# EasyEDA Pro project 控制板+驱动.eprj, board PCB_1
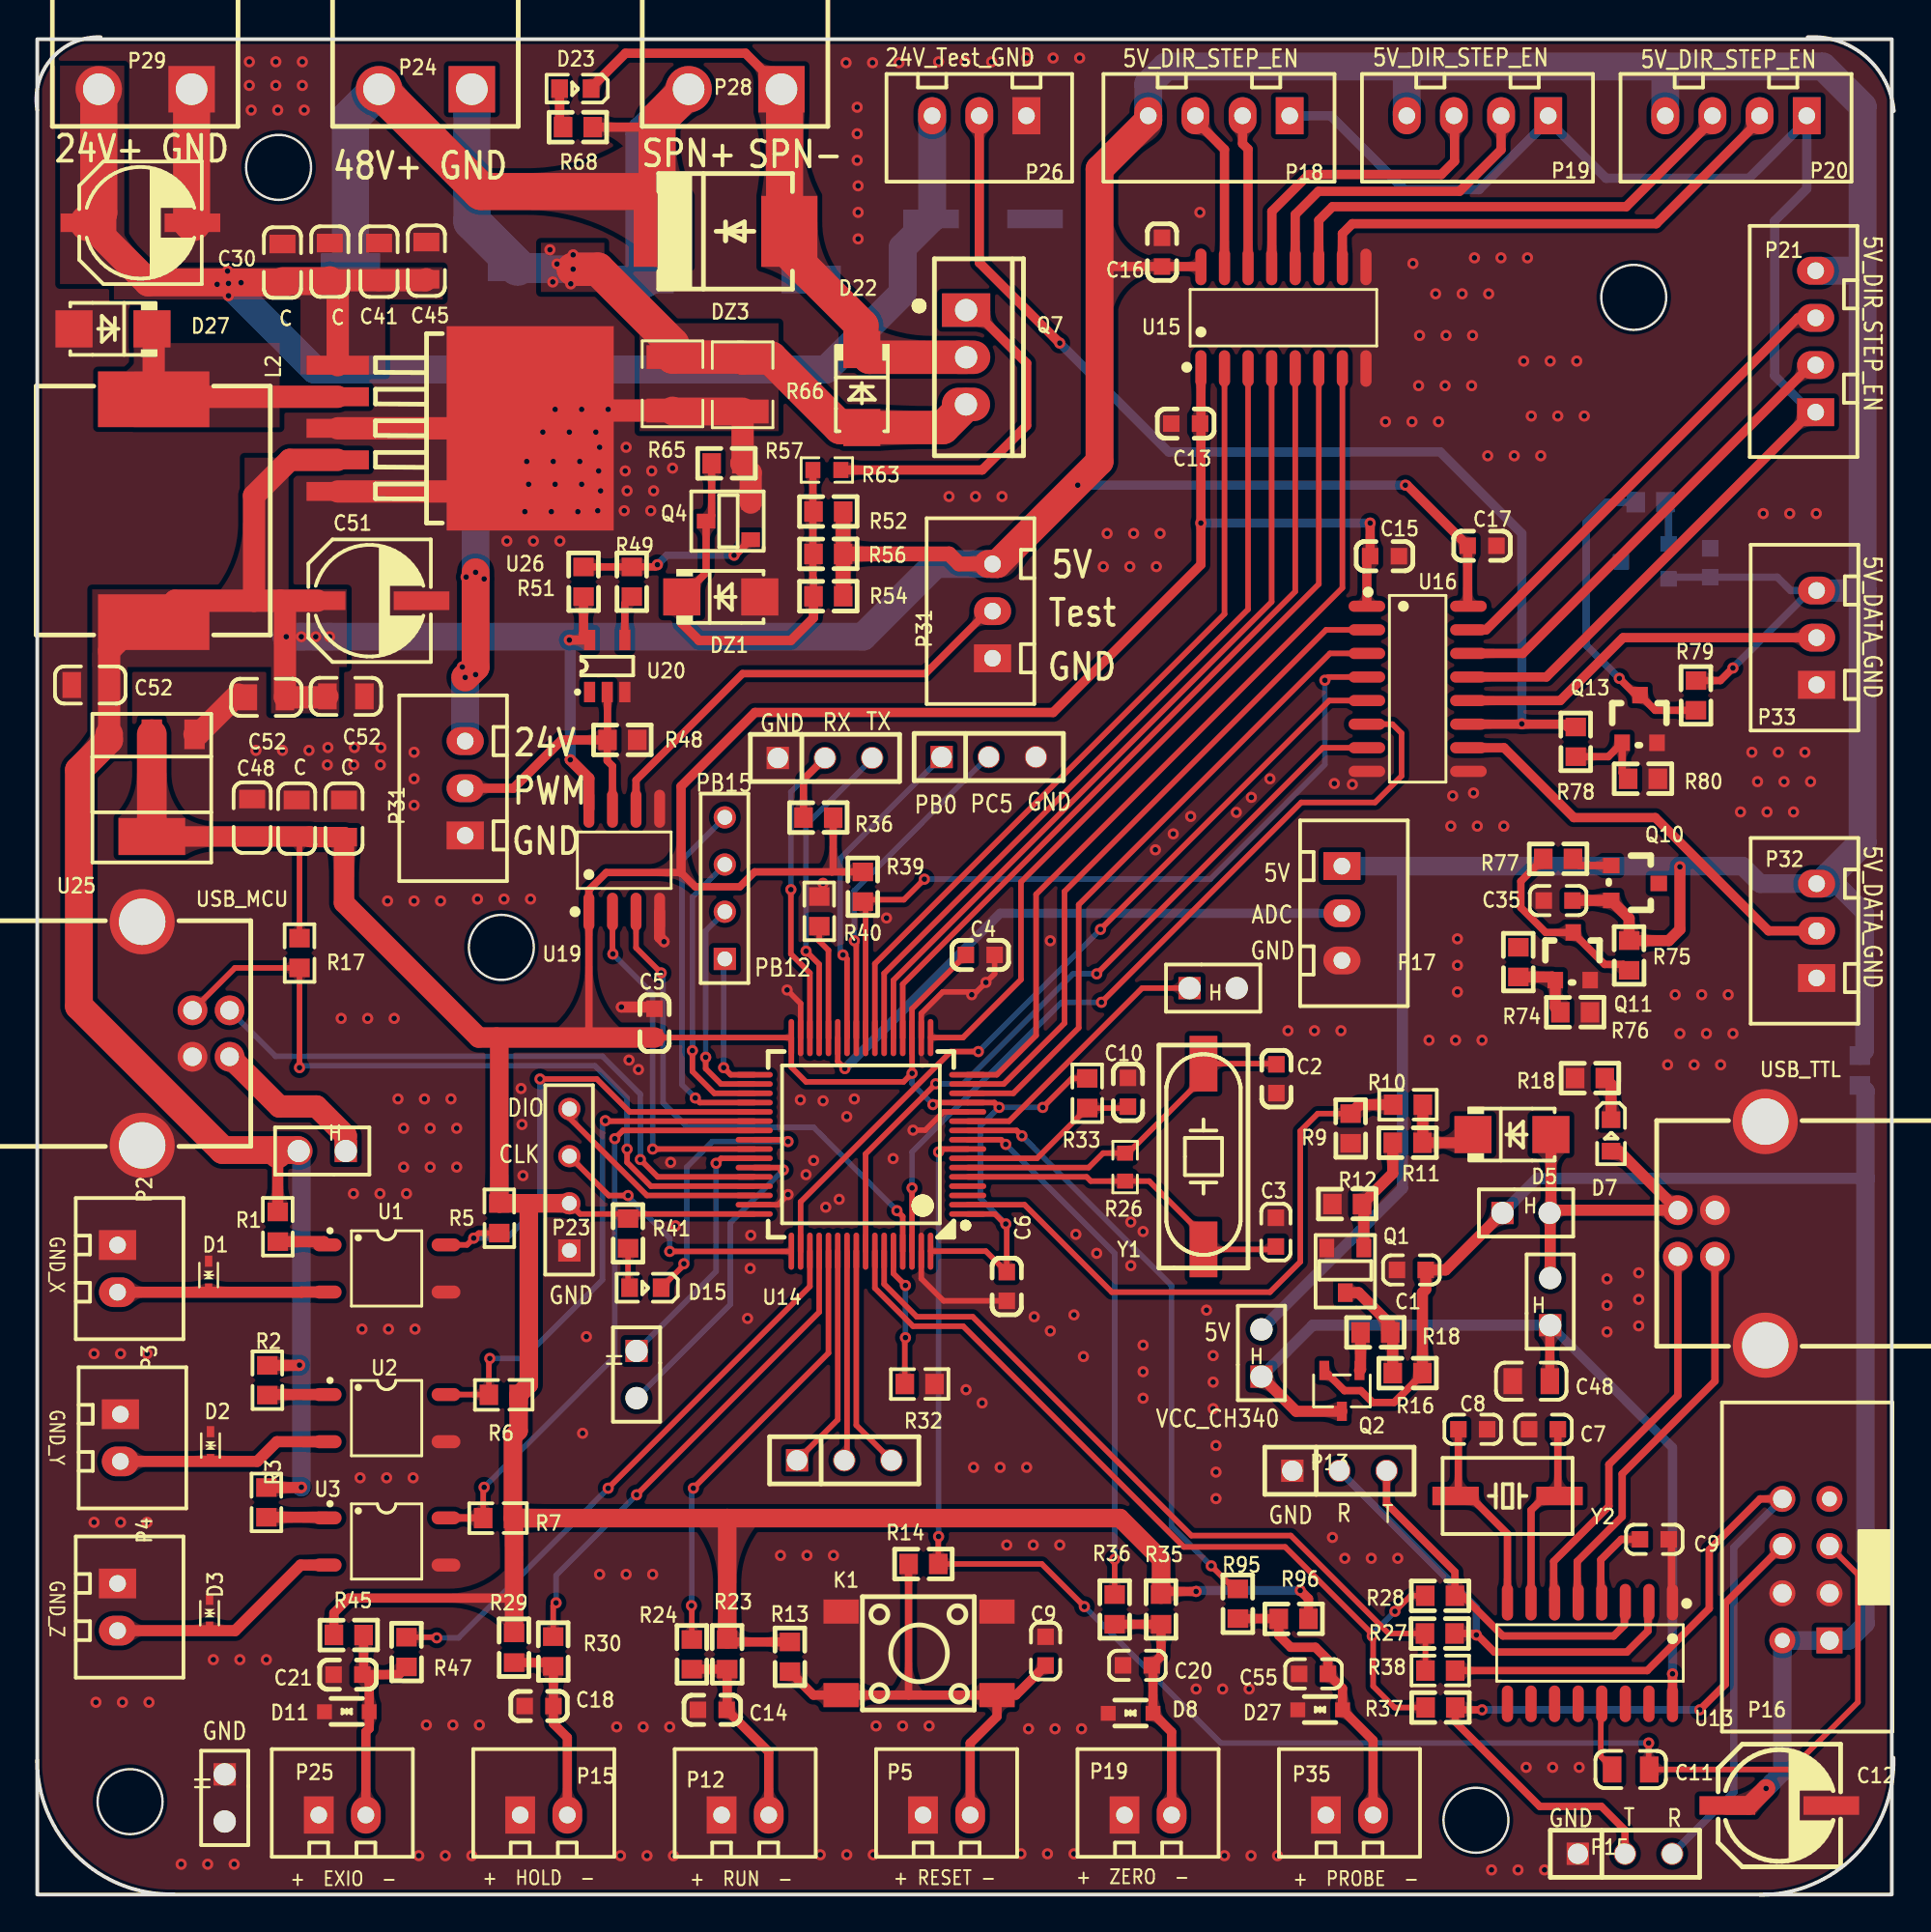
[diagram p4: board, top side]
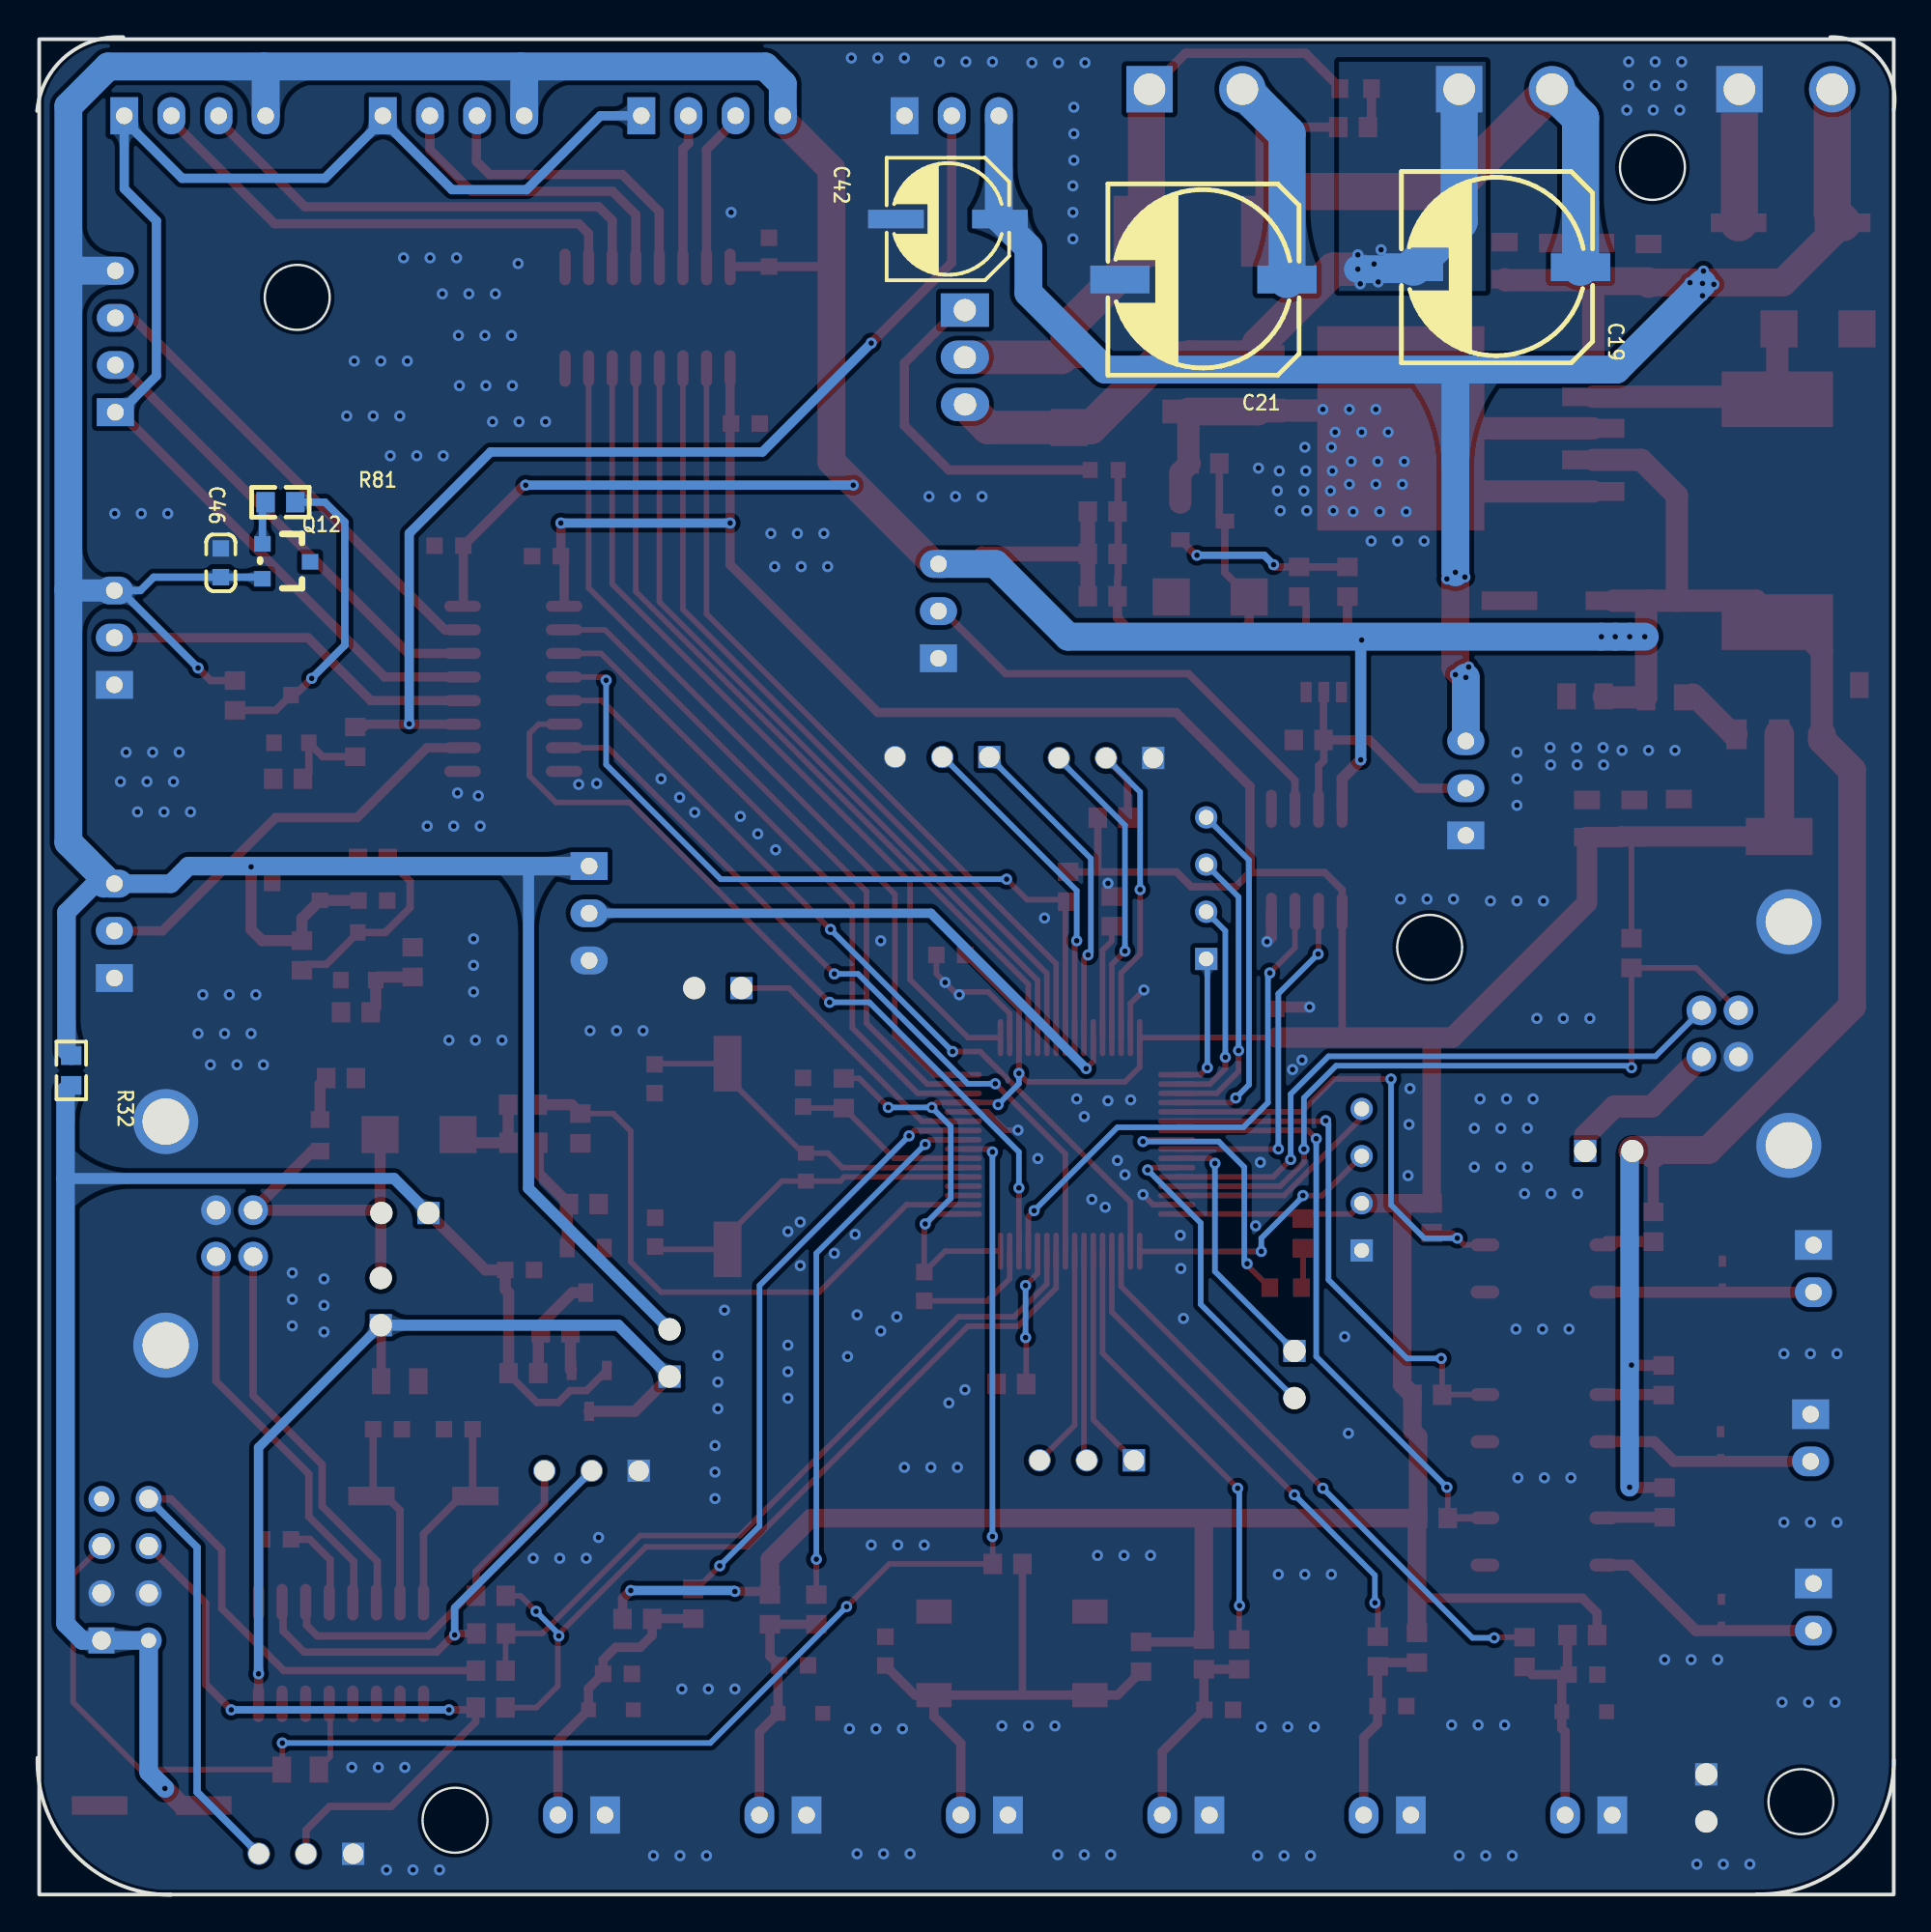
[diagram p5: board, bottom side, seen from below]

Outline 100.02 x 100.03 mm; copper layers: Top Layer, Bottom Layer. Coordinates in mm from the lower left corner of the outline.
Outline path: rectangle 0.01,99.92 99.91,0.02 ; circle c5.01,5.02 r1.75 ; circle c13.01,93.02 r1.75 ; circle c25.01,51.02 r1.75 ; circle c77.51,4.02 r1.75 ; circle c86.01,86.02 r1.75 ; 0.01,96.1 arc(0.78,98.88) 3.42,100.03 ; 7.37,0.03 arc(2.15,2.09) 0,7.27 ; 95.38,100.03 arc(98.5,98.98) 100.02,96.05 ; 100,7.38 arc(97.97,2.16) 92.81,0
Stack: Top Layer 0.035mm / Dielectric1 1.51mm FR4 er 4.5 / Bottom Layer 0.035mm

## Design rules (mm)
template: 用户自定义配置
spacing Default (default): track to track 0.152, other pairs 0 to 0.152
track width Default (default): min 0.254, default 0.254, max 25.4
differential pair differentialPair (default): width min 0.127, default 0.254, max 2.54; gap min 0.152, default 0.152
via Default (default): diameter min 0.25, default 0.61, max 100.025; hole min 0.2, default 0.305, max 59.995

## Placement (name value [footprint] x y rotation side)
C  -  [0805C]  16.53 57.95 270 top
C1  104  [0603C]  74.03 33.65 0 top
C2  -  [0603C]  66.76 43.95 270 top
C3  -  [0603C]  66.73 35.69 90 top
C4  104  [0603C]  50.8 50.61 180 top
C5  104  [0603C]  33.26 46.94 270 top
C6  104  [0603C]  52.23 32.76 90 top
C7  -  [0603C]  81.14 25.07 180 top
C8  -  [0603C]  77.33 25.07 0 top
C9  -  [0603C]  87.12 19.14 0 top
C9#2  -  [0603C]  54.32 13.12 270 top
C10  104  [0603C]  58.76 43.22 270 top
C11  104  [0805C]  85.84 6.75 0 top
C12  100uF/35V  [电解电容贴片6X6]  93.85 4.81 0 top
C13  104  [0603C]  61.87 79.22 180 top
C14  103  [0603C]  36.37 9.96 0 top
C15  104  [0603C]  72.58 72.08 0 top
C16  104  [0603C]  60.59 88.45 270 top
C17  104  [0603C]  77.83 72.64 180 top
C18  103  [0603C]  27.04 10.17 0 top
C19  100uF/63V  [电解电容贴片10x10]  21.12 87.74 0 bottom
C20  103  [0603C]  59.27 12.36 0 top
C21  -  [0603C]  16.74 11.86 0 top
C21#2  -  [电解电容贴片10x10]  36.93 87.08 0 bottom
C30  100uF/35V  [电解电容贴片6x6]  5.57 90.03 0 top
C35  104  [0603C]  81.93 53.54 0 top
C41  104  [0805C]  18.42 87.94 270 top
C42  100uF/35V  [电解电容贴片6x6]  50.96 90.24 0 bottom
C45  104  [0805C]  20.97 87.99 270 top
C46  104  [0603C]  90.12 71.72 270 bottom
C48  -  [0805C]  11.58 58.01 270 top
C48#2  -  [0805C]  80.49 27.66 0 top
C51  100uF/35V  [电解电容贴片6x6]  17.91 69.68 0 top
C52  -  [0805C]  12.35 64.48 0 top
C52#2  -  [0805C]  2.86 65.15 0 top
C52#3  -  [0805C]  16.63 64.53 180 top
C55  103  [0603C]  68.76 11.9 0 top
C#2  -  [0805C]  13.22 87.89 270 top
C#3  -  [0805C]  15.77 87.94 270 top
C#4  -  [0805C]  13.98 57.95 270 top
D1  ESD05V52D-C  [SOD-523_L1.2-W0.8-LS1.6-BI]  9.24 33.37 90 top
D2  ESD05V52D-C  [SOD-523_L1.2-W0.8-LS1.6-BI]  9.34 24.19 90 top
D3  ESD05V52D-C  [SOD-523_L1.2-W0.8-LS1.6-BI]  9.29 15.16 90 top
D5  SS56  [SMA]  79.44 40.94 0 top
D7  红光  [0603LED]  84.76 40.93 90 top
D8  PESD03V32D-LC  [SOD-323_L1.7-W1.3-LS2.5-BI]  58.9 9.77 0 top
D11  PESD03V32D-LC  [SOD-323_L1.7-W1.3-LS2.5-BI]  16.68 9.86 0 top
D15  绿光  [0603LED]  32.8 32.71 0 top
D22  SS56  [SMA]  44.43 81.11 270 top
D23  -̹-  [0603LED]  29.03 97.28 0 top
D27  -  [SOD-323_L1.7-W1.3-LS2.5-BI]  69.11 9.96 0 top
D27#2  -  [SMA]  4.09 84.32 180 top
DZ1  --ѹ------SMAZ10V  [SMA]  36.83 69.89 0 top
DZ3  RS5M  [SMC]  37.08 89.58 0 top
H  -  [HDR-TH_2P-P2.54-V-M]  80.21 36.72 0 top
H#2  -  [HDR-TH_2P-P2.54-V-M]  32.29 28.02 270 top
H#3  -  [HDR-TH_2P-P2.54-V-M]  65.95 29.18 90 top
H#4  -  [HDR-TH_2P-P2.54-V-M]  81.51 31.94 90 top
H#5  -  [HDR-TH_2P-P2.54-V-M]  63.35 48.83 0 top
H#6  -  [HDR-TH_2P-P2.54-V-M]  10.1 5.22 270 top
H#7  -  [HDR-TH_2P-P2.54-V-M]  15.36 40.05 180 top
K1  SW_6X6_H=12.0MM  [KEY-SMD_4P-L6.0-W6.0-P4.50-LS9.0]  47.51 13.01 0 top
L2  33uH  [IND-SMD_L13.45-W12.6]  6.28 74.53 270 top
P  PZ254V-11-03P  [HDR-TH_3P-P2.54-V-M]  51.26 61.27 0 top
P2  2P  [HDR1X2_CON]  4.33 33.72 270 top
P3  2P  [HDR1X2_CON]  4.48 24.61 270 top
P4  2P  [HDR1X2_CON]  4.33 15.5 270 top
P5  2P  [HDR1X2_CON]  48.99 4.3 0 top
P12  2P  [HDR1X2_CON]  38.14 4.3 0 top
P13  -  [HDR-TH_3P-P2.54-V-M]  70.15 22.84 0 top
P13#2  -  [HDR-TH_3P-P2.54-V-M]  43.48 23.4 0 top
P14  PZ254V-11-03P  [HDR-TH_3P-P2.54-V-M]  42.44 61.22 0 top
P15  -  [HDR-TH_3P-P2.54-V-M]  85.53 2.21 0 top
P15#2  -  [HDR1X2_CON]  27.29 4.3 0 top
P16  8P  [IDC8]  95.53 17.51 90 top
P17  3P  [HDR1X3_CON]  70.29 52.85 270 top
P18  4P  [HDR1X4_CON]  67.47 95.8 180 top
P19  -  [HDR1X4_CON]  81.4 95.8 180 top
P19#2  -  [HDR1X2_CON]  59.84 4.3 0 top
P20  4P  [HDR1X4_CON]  95.32 95.8 180 top
P21  4P  [HDR1X4_CON]  95.8 79.83 90 top
P23  -  [SIP4]  28.67 34.7 90 top
P23#2  -  [SIP4]  37.04 50.4 90 top
P24  DB2ER-5.0-2P-GN  [CONN-TH_2P-P5.00_DB2ER-5.0-2P-GN]  20.92 97.22 180 top
P25  2P  [HDR1X2_CON]  16.44 4.3 0 top
P26  3P  [HDR1X3_CON]  50.75 95.8 180 top
P28  DB2ER-5.0-2P-GN  [CONN-TH_2P-P5.00_DB2ER-5.0-2P-GN]  37.59 97.22 180 top
P29  DB2ER-5.0-2P-GN  [CONN-TH_2P-P5.00_DB2ER-5.0-2P-GN]  5.82 97.22 180 top
P31  -  [HDR1X3_CON]  23.06 59.59 90 top
P31#2  -  [HDR1X3_CON]  51.47 69.12 90 top
P32  3P  [HDR1X3_CON]  95.86 51.91 90 top
P33  3P  [HDR1X3_CON]  95.85 67.7 90 top
P35  2P  [HDR1X2_CON]  70.69 4.3 0 top
Q1  SS8050  [SOT-23]  70.47 33.63 180 top
Q2  AO3401  [SOT-23-3_L3.0-W1.7-P0.95-LS2.9-BR]  70.28 27.14 90 top
Q4  SS8050  [SOT-23]  37.24 73.97 90 top
Q7  IRFB4110PBF/不贴  [TO-220-3_L10.0-W4.5-P2.54-L]  50.04 82.79 270 top
Q10  AO3401  [SOT-23#2]  84.79 55.43 270 top
Q11  SS8050  [SOT-23#2]  81.78 49.26 0 top
Q12  AO3401  [SOT-23#2]  87.88 72.74 270 bottom
Q13  SS8050  [SOT-23#2]  85.38 62.03 0 top
R1  1K  [0603R]  12.96 35.97 270 top
R2  1K  [0603R]  12.4 27.71 270 top
R3  1K  [0603R]  12.35 21.13 270 top
R5  10K  [0603R]  24.89 36.43 270 top
R6  10K  [0603R]  25.13 26.92 180 top
R7  10K  [0603R]  24.83 20.29 180 top
R9  10K  [0603R]  70.75 41.27 270 top
R10  5.1K  [0603R]  73.84 42.55 180 top
R11  2K  [0603R]  73.82 40.5 0 top
R12  10K  [0603R]  70.57 37.2 0 top
R13  10K  [0603R]  40.55 12.82 90 top
R14  100  [0603R]  47.74 17.82 180 top
R16  10K  [0603R]  73.82 28.09 0 top
R17  -  [0603R]  14.13 50.71 270 top
R18  -  [0603R]  83.65 43.98 180 top
R18#2  -  [0603R]  72.09 30.28 0 top
R23  10K  [0603R]  37.17 12.95 90 top
R24  100  [0603R]  35.27 12.95 270 top
R26  1M  [R0603]  58.61 39.19 90 top
R27  510Ω  [0603R]  75.56 14.07 180 top
R28  510Ω  [0603R]  75.58 16.1 180 top
R29  10K  [0603R]  25.69 13.31 90 top
R30  100  [0603R]  27.8 13.1 270 top
R32  -  [0603R]  47.54 27.51 180 top
R32#2  -  [0603R]  98.18 44.39 270 bottom
R33  -  [0603R]  56.57 43.16 270 top
R35  10K  [0603R]  60.54 15.37 90 top
R36  -  [0603R]  42.08 58.01 0 top
R36#2  -  [0603R]  58.04 15.37 270 top
R37  510Ω  [0603R]  75.59 10.09 0 top
R38  510Ω  [0603R]  75.58 12.08 0 top
R39  -  [0603R]  44.48 54.28 90 top
R40  10K  [0603R]  42.13 52.96 90 top
R41  50K  [0603R]  31.83 35.62 90 top
R45  10K  [0603R]  16.79 13.99 180 top
R47  100  [0603R]  19.9 13.07 270 top
R48  10K  [0603R]  31.53 62.19 0 top
R49  100  [0603R]  32.03 70.7 90 top
R51  10K  [0603R]  29.43 70.7 270 top
R52  20K  [0603R]  42.62 74.48 0 top
R54  20K  [0603R]  42.62 69.92 0 top
R56  20K  [0603R]  42.62 72.2 0 top
R57  10K  [0603R]  37.13 77.08 0 top
R63  100Ω  [R0603]  42.54 76.72 0 top
R65  0Ω  [R1210]  34.23 81.36 90 top
R66  0Ω  [R1210]  38 81.31 90 top
R68  200K  [0603R]  29.13 95.19 180 top
R74  3K  [0603R]  79.79 50.22 90 top
R75  10K  [0603R]  85.76 50.58 90 top
R76  10K  [0603R]  82.85 47.52 0 top
R77  1K  [0603R]  81.93 55.78 0 top
R78  3K  [0603R]  82.88 62.09 90 top
R79  10K  [0603R]  89.36 64.58 90 top
R80  10K  [0603R]  86.5 60.1 0 top
R81  1K  [0603R]  86.91 74.99 0 bottom
R95  100  [0603R]  64.68 15.68 270 top
R96  10K  [0603R]  67.68 14.86 0 top
U1  LTV-357T-C  [SOP-4_L4.4-W3.9-P2.54-LS7.0-TL]  18.82 33.73 0 top
U2  LTV-357T-C  [SOP-4_L4.4-W3.9-P2.54-LS7.0-TL]  18.82 25.67 0 top
U3  LTV-357T-C  [SOP-4_L4.4-W3.9-P2.54-LS7.0-TL]  18.82 19.03 0 top
U13  CH340G  [SOIC-16_L9.9-W3.9-P1.27-LS6.0-BL]  83.65 13.02 180 top
U14  STM32F103RBT6/RCT6  [LQFP-64_L10.0-W10.0-P0.50-LS12.0-BL]  44.38 40.41 90 top
U15  CA-IS3760  [SOIC-16_L9.9-W3.9-P1.27-LS6.0-BL]  67.14 84.92 0 top
U16  CA-IS3760  [SOIC-16_L9.9-W3.9-P1.27-LS6.0-BL]  74.37 64.94 270 top
U19  CA-IS3720LS  [SOIC-8_L4.9-W3.9-P1.27-LS6.0-BL]  31.63 55.71 0 top
U20  74LVC1G04  [SOT-23-5]  30.71 66.17 90 top
U25  1117-3.3  [SOT-223]  6.18 59.79 180 top
U26  LM2596S-5.0RG  [TO-263-5_L10.1-W8.7-P1.70-LS15.2-BR]  21.38 78.97 180 top
USB_MCU  USB-B10-BRW  [USB-B-TH_USB-B10-BRW]  8.01 46.38 270 top
USB_TTL  USB-B10-BRW  [USB-B-TH_USB-B10-BRW]  90.74 35.62 90 top
Y1  8M  [晶振贴片]  62.83 39.76 90 top
Y2  12M  [晶振贴片49SSMD]  79.21 21.48 0 top

## Footprints (pads in the part's own frame, mm; a bottom-side part is the same pattern mirrored in y, then rotated)
0603C
  rect 0.889x0.889 smd: 1(-0.774,0) 2(0.774,0)
0603LED
  rect 0.9x1 smd: 1(-0.884,-0.017) 2(0.816,-0.017)
0603R
  rect 1x1.1 smd: 1(-0.8,0) 2(0.8,0)
0805C
  rect 1x1.4 smd: 1(-1,0) 2(1,0)
CONN-TH_2P-P5.00_DB2ER-5.0-2P-GN
  rect 2.5x2.5 hole 1.7: 1(-2.5,0)
  round 2.5 hole 1.7: 2(2.5,0)
HDR1X2_CON
  rect 1.6x2 hole 0.9: 1(-1.27,0)
  oval 1.6x2 hole 0.9: 2(1.27,0)
HDR1X3_CON
  rect 1.5x2 hole 0.9: 1(-2.54,0)
  oval 1.5x2 hole 0.9: 2(0,0) 3(2.54,0)
HDR1X4_CON
  rect 1.5x2 hole 0.9: 1(0,0)
  oval 1.5x2 hole 0.9: 2(2.54,0) 3(5.08,0) 4(7.62,0)
HDR-TH_2P-P2.54-V-M
  rect 1.2x1.2 hole 1.2x0.8: 1(-1.27,0)
  round 1.2 hole 1.2x0.8: 2(1.27,0)
HDR-TH_3P-P2.54-V-M
  rect 1.2x1.2 hole 1.1x0.8: 1(-2.54,0)
  round 1.2 hole 1.1x0.8: 2(0,0) 3(2.54,0)
IDC8
  rect 1.4x1.4 hole 1: 1(-3.812,-1.019)
  round 1.4 hole 0.8: 2(-3.812,1.521) 7(3.808,-1.019)
  round 1.4 hole 1: 3(-1.272,-1.019) 4(-1.272,1.521) 5(1.268,-1.019) 6(1.268,1.521) 8(3.808,1.521)
IND-SMD_L13.45-W12.6
  rect 3x6 smd: 1(-6,0) 2(6,0)
KEY-SMD_4P-L6.0-W6.0-P4.50-LS9.0
  rect 1.9x1.3 smd: 1(-4.2,2.25) 2(4.2,2.25) 3(-4.2,-2.25) 4(4.2,-2.25)
LQFP-64_L10.0-W10.0-P0.50-LS12.0-BL
  oval 0.3x2 smd: 1(-3.75,-5.75) 2(-3.25,-5.75) 3(-2.75,-5.75) 4(-2.25,-5.75) 5(-1.75,-5.75) 6(-1.25,-5.75) 7(-0.75,-5.75) 8(-0.25,-5.75) 9(0.25,-5.75) 10(0.75,-5.75) 11(1.25,-5.75) 12(1.75,-5.75) 13(2.25,-5.75) 14(2.75,-5.75) 15(3.25,-5.75) 16(3.75,-5.75) 33(3.75,5.75) 34(3.25,5.75) 35(2.75,5.75) 36(2.25,5.75) 37(1.75,5.75) 38(1.25,5.75) 39(0.75,5.75) 40(0.25,5.75) 41(-0.25,5.75) 42(-0.75,5.75) 43(-1.25,5.75) 44(-1.75,5.75) 45(-2.25,5.75) 46(-2.75,5.75) 47(-3.25,5.75) 48(-3.75,5.75)
  oval 2x0.3 smd: 17(5.75,-3.75) 18(5.75,-3.25) 19(5.75,-2.75) 20(5.75,-2.25) 21(5.75,-1.75) 22(5.75,-1.25) 23(5.75,-0.75) 24(5.75,-0.25) 25(5.75,0.25) 26(5.75,0.75) 27(5.75,1.25) 28(5.75,1.75) 29(5.75,2.25) 30(5.75,2.75) 31(5.75,3.25) 32(5.75,3.75) 49(-5.75,3.75) 50(-5.75,3.25) 51(-5.75,2.75) 52(-5.75,2.25) 53(-5.75,1.75) 54(-5.75,1.25) 55(-5.75,0.75) 56(-5.75,0.25) 57(-5.75,-0.25) 58(-5.75,-0.75) 59(-5.75,-1.25) 60(-5.75,-1.75) 61(-5.75,-2.25) 62(-5.75,-2.75) 63(-5.75,-3.25) 64(-5.75,-3.75)
R0603
  rect 0.806x0.864 smd: 1(-0.753,0) 2(0.753,0)
R1210
  rect 1.282x2.808 smd: 1(-1.441,0) 2(1.441,0)
SIP4
  rect 1.2x1.2 hole 0.8: 1(0,0)
  round 1.2 hole 0.8: 2(2.54,0) 3(5.08,0) 4(7.62,0)
SMA
  rect 2x2 smd: 1(2.1,0) 2(-2.1,0)
SMC
  rect 3.03x3.82 smd: 1(3.435,0) 2(-3.435,0)
SOD-323_L1.7-W1.3-LS2.5-BI
  rect 0.8x0.8 smd: 1(-1.205,0) 2(1.205,0)
SOD-523_L1.2-W0.8-LS1.6-BI
  rect 0.6x0.4 smd: 1(-0.75,0) 2(0.75,0)
SOIC-8_L4.9-W3.9-P1.27-LS6.0-BL
  oval 0.588x2.045 smd: 1(-1.905,-2.772) 2(-0.635,-2.772) 3(0.635,-2.772) 4(1.905,-2.772) 5(1.905,2.772) 6(0.635,2.772) 7(-0.635,2.772) 8(-1.905,2.772)
SOIC-16_L9.9-W3.9-P1.27-LS6.0-BL
  oval 0.602x1.971 smd: 1(-4.445,-2.736) 2(-3.175,-2.736) 3(-1.905,-2.736) 4(-0.635,-2.736) 5(0.635,-2.736) 6(1.905,-2.736) 7(3.175,-2.736) 8(4.445,-2.736) 9(4.445,2.736) 10(3.175,2.736) 11(1.905,2.736) 12(0.635,2.736) 13(-0.635,2.736) 14(-1.905,2.736) 15(-3.175,2.736) 16(-4.445,2.736)
SOP-4_L4.4-W3.9-P2.54-LS7.0-TL
  oval 1.55x0.7 smd: 1(-3.2,1.27) 2(-3.2,-1.27) 3(3.2,-1.27) 4(3.2,1.27)
SOT-23
  rect 0.8x1 smd: 1(-1,-1.2) 2(0,1.2) 3(1,-1.2)
SOT-23#2
  rect 0.838x0.889 smd: 1(0,0) 2(1.879,0) 3(0.965,2.566)
SOT-23-3_L3.0-W1.7-P0.95-LS2.9-BR
  rect 1.038x0.532 smd: 1(1.101,-0.95) 2(1.101,0.95) 3(-1.101,0)
SOT-23-5
  rect 1.1x0.6 smd: 1(-1.4,0.95) 2(-1.4,0) 3(-1.4,-0.95) 4(1.4,-0.95) 5(1.4,0.95)
SOT-223
  rect 1.1x1.6 smd: 1(-2.3,-2.7) 2(0,-2.7) 3(2.3,-2.7)
  rect 3.6x2 smd: 4(0,2.8)
TO-220-3_L10.0-W4.5-P2.54-L
  rect 1.8x2.6 hole 1.2: 1(-2.54,0.005)
  oval 1.8x2.6 hole 1.2: 2(0,0.005) 3(2.54,-0.005)
TO-263-5_L10.1-W8.7-P1.70-LS15.2-BR
  rect 3.358x1.02 smd: 1(5.183,-3.4) 2(5.183,-1.7) 3(5.183,0) 4(5.183,1.7) 5(5.183,3.4)
  rect 9x11 smd: 6(-5.184,0)
USB-B-TH_USB-B10-BRW
  round 1.6 hole 1: 1(1.25,2.355) 2(-1.25,2.355) 3(-1.25,0.355) 4(1.25,0.355)
  round 3.5 hole 2.5: 5(-6.02,-2.355) 6(6.02,-2.355)
晶振贴片
  rect 3x1.5 smd: 1(-5,0) 2(5,0)
晶振贴片49SSMD
  rect 2.5x1 smd: 1(-2.8,0) 2(2.8,0)
电解电容贴片6x6
  rect 3x1 smd: 1(-2.8,0) 2(2.8,0)
电解电容贴片6X6
  rect 3x1 smd: 1(-2.8,0) 2(2.8,0)
电解电容贴片10x10
  rect 3.2x1.5 smd: 1(-4.242,0.097) 2(4.758,0.097)

## Nets
3V3: C.2 C4.2 C5.2 C6.2 C13.1 C15.1 C48.2 C#4.2 P23.2 R5.1 R6.1 R7.1 R13.2 R17.1 R23.2 R29.2 R33.1 R35.2 R36.2 R39.2 R41.2 R45.2 R96.2 U14.1 U14.13 U14.19 U14.32 U14.48 U14.64 U15.1 U16.1 U19.1 U25.2 U25.4
5V_DIS: C1.2 C12.1 H.1 P16.1 P16.2 Q2.2 R16.2 R32#2.2
5V_VCC: C16.2 C17.2 C35.2 C46.2 C51.1 C52.2 C52#2.2 C52#3.2 H#3.2 H#7.2 L2.2 P17.1 P18.4 P19.4 P20.4 P21.4 P31#2.3 P32.3 P33.3 Q10.2 Q12.2 R1.1 R2.1 R3.1 R32#2.1 R51.2 R52.2 R54.2 R56.2 R75.2 R79.2 U15.16 U16.16 U19.8 U20.5 U25.3 U26.4
5V_VCC2: H#7.1 USB_MCU.1
24V: C30.1 C41.2 C42.1 C45.2 C#2.2 C#3.2 P26.3 P29.2 P31.3 U26.1
48V_SPN-: C19.2 D22.1 P24.1 Q7.3 R65.2 R66.2
SGND: C.1 C1.1 C2.2 C3.2 C4.1 C5.1 C6.1 C7.2 C8.2 C9.2 C9#2.1 C10.1 C12.2 C13.2 C14.1 C15.2 C16.1 C17.1 C18.1 C20.1 C21.1 C21#2.2 C30.2 C35.1 C41.1 C42.2 C45.1 C46.1 C48.1 C48#2.1 C51.2 C52.1 C52#2.1 C52#3.1 C55.1 C#2.1 C#3.1 C#4.1 D1.2 D2.2 D3.2 D8.1 D11.1 D27.1 D27#2.1 DZ1.1 H#5.2 H#6.1 H#6.2 K1.1 K1.2 P.3 P2.1 P3.1 P4.1 P5.1 P12.1 P13.1 P14.1 P15.1 P15#2.1 P16.3 P16.4 P17.3 P19#2.1 P23.1 P25.1 P26.1 P29.1 P31.1 P31#2.1 P32.1 P33.1 P35.1 Q1.3 Q4.3 Q11.2 Q13.2 R9.2 R12.1 R18.2 R32.1 R40.2 R48.2 R57.2 R65.1 R66.1 R76.2 R80.2 U1.3 U2.3 U3.3 U13.1 U14.12 U14.18 U14.31 U14.47 U14.63 U15.8 U15.9 U16.8 U16.9 U19.4 U19.5 U20.3 U25.1 U26.3 U26.5 U26.6 USB_MCU.4 USB_MCU.5 USB_MCU.6 USB_TTL.4 USB_TTL.5 USB_TTL.6
ADC: P17.2 U14.27
BEEP: H#5.1 U14.11
BOOT0: R32.2 U14.60
BOOT1: R40.1 U14.28
D+: R17.2 U14.45 USB_MCU.3
D-: U14.44 USB_MCU.2
EXIO: R47.1 U14.51
HOLD: R30.1 U14.52
LASER_CTRL: P.1 U14.26
LED_SYS: D15.2 U14.40
M_EN_OUT: P18.1 P19.1 P20.1 P21.1 U16.13
MA_DIR: U14.15 U16.2
MA_DIR_OUT: P21.3 U16.15
MA_ST_OUT: P21.2 U16.14
MA_STEP: U14.14 U16.3
MOTOR_EN: R39.1 U14.24 U16.4
MX_DIR: U14.23 U15.2
MX_DIR_OUT: P18.3 U15.15
MX_ST_OUT: P18.2 U15.14
MX_STEP: U14.22 U15.3
MY_DIR: U14.21 U15.4
MY_DIR_OUT: P19.3 U15.13
MY_ST_OUT: P19.2 U15.12
MY_STEP: U14.20 U15.5
MZ_DIR: U14.17 U15.6
MZ_DIR_OUT: P20.3 U15.11
MZ_ST_OUT: P20.2 U15.10
MZ_STEP: U14.16 U15.7
NRST: C10.2 R33.2 U14.7
PA9: H#2.1 U14.42
PA10: H#2.2 U14.43
PB3: P13#2.2 U14.55
PB4: P13#2.3 U14.56
PD2: P13#2.1 U14.54
PROBE: R95.1 U14.10
PUMP_CTRL: P.2 U14.25
PWM_COOL: U14.61 U19.3
PWM_OUT: P31#2.2 U19.6
RGB_DATA1: U14.57 U16.7
RGB_DATA2: U14.50 U16.5
RGB_OUT1: P32.2 U16.10
RGB_OUT2: P33.2 U16.12
RGB_P1: P23#2.3 U14.35
RGB_P2: P23#2.4 U14.36
RGB_PO1: R74.2
RGB_PO2: P26.2 R78.2 U16.11
RST: C11.2 P16.5 R14.1 U14.8
RUN: R24.1 U14.53
RXD: R27.2 R38.1 U14.59
RXD3: P14.2 R36.1 U14.30
SPINDLE_EN0: P23#2.1 U14.33
SPINDLE_EN1: P23#2.2 U14.34
SPINDLE_OUT: P31.2 R48.1 U19.7 U20.2
SPINDLE_PWM: U14.41 U19.2
SPN+: C19.1 C21#2.1 DZ3.2 P24.2 P28.2 R68.1
SPN_PWM: DZ1.2 Q4.2 R52.1 R54.1 R56.1 R57.1 R63.1
SPN_PWM_OUT: Q7.1 R63.2
SWCLK: P23.3 U14.49
SWDIO: P23.4 U14.46
TIM4_CH4: U14.62 U16.6
TXD: R28.2 R37.1 U14.58
TXD3: P14.3 U14.29
USB_CHK: R9.1 R10.2 U14.2
USB_DM: U13.6 USB_TTL.2
USB_DP: U13.5 USB_TTL.3
VCH340: C48#2.2 H#3.1 H#4.1 Q2.3 U13.16
VUSB: D5.1 D7.1 H.2 H#4.2 USB_TTL.1
X_LIMT: R5.2 U1.4 U14.37
X_LO: D1.1 P2.2 U1.2
XTAL1: C3.1 R26.1 U14.5 Y1.1
XTAL2: C2.1 R26.2 U14.6 Y1.2
Y_LIMT: R6.2 U2.4 U14.38
Y_LO: D2.1 P3.2 U2.2
Z_LIMT: R7.2 U3.4 U14.39
Z_LO: D3.1 P4.2 U3.2
ZERO: R36#2.1 U14.9
$1N23: C14.2 P12.2 R23.1 R24.2
$1N24: C18.2 P15#2.2 R29.1 R30.2
$1N115: C21.2 D11.2 P25.2 R45.1 R47.2
$1N25015: C9.1 U13.4
$1N25025: C11.1 U13.13
$1N25043: C7.1 U13.7 Y2.2
$1N25047: C8.1 U13.8 Y2.1
$1N25180: D15.1 R41.1
$1N25225: U14.3
$1N25227: U14.4
$1N25288: P15.2 P16.6 R37.2
$1N25293: P15.3 P16.8 R38.2
$1N25300: R1.2 U1.1
$1N25317: Q2.1 R18#2.1
$1N25319: Q1.2 R16.1 R18#2.2
$1N25330: P13.2 R27.1 U13.2
$1N25334: P13.3 R28.1 U13.3
$1N25342: D7.2 R18.1
$1N25345: Q1.1 R11.1 R12.2
$1N25456: R2.2 U2.1
$1N25466: R3.2 U3.1
$1N25569: D5.2 R10.1 R11.2
$1N28653: C9#2.2 K1.3 K1.4 P5.2 R13.1 R14.2
$1N38223: C20.2 D8.2 P19#2.2 R35.1 R36#2.2
$1N68371: C55.2 D27.2 P35.2 R95.2 R96.1
$6N26743: D22.2 D23.2 DZ3.1 P28.1 Q7.2
$6N26746: D23.1 R68.2
$6N26802: Q4.1 R49.2 R51.1
$6N26803: R49.1 U20.4
$6N26814: Q13.1 R78.1 R80.1
$6N26816: Q12.1 R81.2
$6N26817: Q13.3 R79.1 R81.1
$6N26821: Q12.3
$6N26825: Q11.1 R74.1 R76.1
$6N26827: Q10.1 R77.2
$6N26828: Q11.3 R75.1 R77.1
$6N26832: Q10.3
$6N26878: D27#2.2 L2.1 U26.2

Pads without a net: P16 7; U13 9 10 11 12 14 15; U20 1

## Via types
v1: diameter 0.6, hole 0.3, Top Layer to Bottom Layer, 398 vias

## Routing (per net, layer and track width the routed paths; a pad name or vN(x,y) marks a point on that pad's centre or on a via; arc(x,y) is an arc through that point)
3V3: length 299.3
  Top Layer w0.3: C#4.2 14.13,56.8 R17.1 ; v1(51.82,42.4) 51.56,42.66 U14.13 48.36,42.66 v1(48.25,42.55) ; U14.64 51.11,34.66 C6.2 52.23,36.02 51.59,36.66 U14.1 ; U14.48 29.25,36.66 P23.2 ; v1(54.17,42.4) 55.73,43.96 R33.1 ; C5.2 34,46.16 34.01,46.16 U14.32 40.63,44.57 41.42,43.78 46.67,43.78 v1(47.13,44.24) 47.13,46.16 U14.19 47.13,47.71 C4.2
  Top Layer w0.4: 42.82,55.08 42.88,55.14 R36.2 ; 42.82,55.08 38.65,55.08 37.85,54.28 35.45,54.28 34.69,55.05 30.66,55.05 29.72,54.11 U19.1 29.72,46.61 29.48,46.38 ; 42.82,55.08 R39.2
  Top Layer w0.5: v1(62.43,16.34) 60.71,16.34 R35.2 ; 25.69,16.15 25.52,15.98 16.79,15.98 15.99,15.18 R45.2 ; U16.1 71.63,71.91 71.81,72.08 v1(71.81,73.87) ; U15.1 62.69,71.63 54.73,63.67 38.66,63.67 34.69,59.69 34.69,55.05 ; v1(68.04,16.39) 68.48,15.95 R96.2 ; R23.2 37.3,13.62 R13.2
  Top Layer w1: 24.75,46.16 24.89,46.02 R5.1 24.9,37.24 26.49,37.24 ; R7.1 25.69,20.23 R29.2 ; R7.1 37.17,20.29 ; R7.1 25.63,24.67 25.93,24.98 R6.1 26.49,27.48 26.49,37.24 ; P23.2 26.49,37.24 ; R23.2 37.17,20.29 ; 37.17,20.29 58.33,20.29 60.54,18.07 R35.2
  Top Layer w1.1: U25.4 14.69,56.99 14.73,56.95 C.2 16.53,53.42 23.78,46.16 C5.2
  Top Layer w1.6: U25.2 U25.4
  Bottom Layer w0.3: v1(47.13,44.24) 47.13,43.67 v1(48.25,42.55) ; v1(52.18,36.13) 50.8,37.5 50.8,41.38 v1(51.82,42.4) v1(54.17,42.4)
  Bottom Layer w0.5: v1(68.04,16.39) 62.48,16.39 v1(62.43,16.34) ; v1(71.81,73.87) v1(62.69,73.87)
5V_DIS: length 82.8
  Top Layer w0.4: Q2.2 70.42,27.15 71.31,27.15 71.94,26.51 73.1,26.51 74.62,28.04
  Top Layer w0.6: H.1 75.87,33.65 C1.2 74.8,32.61 74.62,32.43 R16.2
  Top Layer w1: C12.1 92.22,4.81 v1(93.13,5.73)
  Bottom Layer w0.6: 98.49,38.57 80.79,38.57 H.1
  Bottom Layer w1: R32#2.2 98.49,43.28 98.49,14.61 97.58,13.7 P16.1 P16.2 94.01,6.61 v1(93.13,5.73)
5V_VCC: length 401.5
  Top Layer w0.4: v1(91.35,66.06) 90.67,65.38 R79.2
  Top Layer w0.5: 57.64,87.84 57.8,87.68 C16.2 62.67,87.68 U15.16 ; U16.16 77.06,69.43 77.06,72.34 ; R51.2 29.43,67.89 U20.5 v1(28.67,67.57) ; v1(73.7,75.91) 73.79,75.91 C17.2
  Top Layer w0.6: v1(28.72,61.12) 29.72,60.11 U19.8 ; v1(88.49,55.35) 88.49,51.98 87.89,51.38 R75.2 85.76,52.58 84.79,53.55 82.71,53.55 C35.2 ; v1(14.13,28.53) 14.12,28.51 R2.1 ; v1(14.24,21.95) 14.22,21.93 R3.1 ; 12.96,39.87 R1.1
  Top Layer w0.8: R56.2 R54.2 ; R56.2 R52.2 ; R56.2 49.13,72.2 49.67,71.66 P31#2.3
  Top Layer w1.2: 11.69,69.68 11.69,75.35 13.61,77.27 U26.4 ; 11.69,69.68 7.43,69.68 L2.2 5.43,68.53 3.88,66.98 U25.3 ; 11.69,69.68 13.11,69.68 ; 13.11,69.68 13.35,69.45 C52.2 15.58,64.48 C52#3.2 ; 13.11,69.68 C51.1
  Top Layer w1.5: 12.73,40.1 10,40.1 2.25,47.86 2.25,60.56 3.88,62.18 U25.3 ; 12.73,40.1 14.04,40.1 H#7.2 ; 12.73,40.1 12.96,39.87 ; P31#2.3 51.72,71.66 57.23,77.18 57.23,92.92 59.85,95.55 P18.4
  Bottom Layer w0.4: Q12.2 87.97,70.95 C46.2 93.74,70.95 94.45,70.23 95.52,70.23 v1(91.35,66.06)
  Bottom Layer w0.5: v1(73.7,75.91) v1(56.06,75.91)
  Bottom Layer w0.6: 73.55,55.39 73.55,38.05 H#3.2 ; v1(28.67,67.57) 28.72,67.51 v1(28.72,61.12)
  Bottom Layer w1: P17.1 91.87,55.39 92.82,54.45 96.9,54.45 98.44,52.91 98.44,45.44 R32#2.1 ; H#7.2 14.24,39.91 v1(14.24,21.95)
  Bottom Layer w1.2: 95.85,70.23 98.3,70.23 98.34,70.27
  Bottom Layer w1.5: 73.97,98.45 73.78,98.26 P19.4 ; 73.97,98.45 87.79,98.45 ; 73.97,98.45 60.8,98.45 59.85,97.5 P18.4 ; v1(13.42,67.75) v1(14.23,67.75) v1(15.01,67.75) v1(15.75,67.75) 44.48,67.75 48.4,71.66 P31#2.3 ; P20.4 87.7,98.36 87.79,98.45 ; 87.79,98.45 96.19,98.45 98.34,96.31 98.34,56.68 96.42,54.76 96.42,54.45 ; 98.13,87.59 98,87.45 P21.4
5V_VCC2: length 8.8
  Top Layer w1.2: USB_MCU.1 13.05,42.45 15.05,42.45 16.63,40.87 H#7.1
24V: length 102
  Top Layer w1.2: C45.2 20.92,86.94 C41.2 C#3.2 16.19,86.52 U26.1
  Top Layer w1.5: C30.1 5.98,86.82 13.13,86.82 ; C#3.2 15.71,86.89 C#2.2 ; v1(23.06,65.55) 23.62,66.11 v1(23.62,71.21) ; 13.14,86.82 13.22,86.74
  Top Layer w2: P29.2 3.32,90.59 C30.1
  Bottom Layer w1.5: v1(23.62,71.21) 23.62,81.72 23.77,81.87 ; v1(10.31,86.77) 14.95,82.13 42.49,82.13 46.62,86.26 46.62,88.7 48.21,90.29 P26.3 ; P31.3 v1(23.06,65.55)
  vias: v1(9.7,86.72) v1(10.26,87.43) v1(10.31,86.11) v1(10.98,86.81) v1(22.91,66.11) v1(23.11,70.96) v1(23.62,65.71) v1(24.08,70.86)
48V_SPN-: length 39.1
  Top Layer w1.8: v1(28.87,87.53) 30.2,87.53 34.23,83.51 R65.2 37.95,82.81 R66.2 39.52,82.75 43.26,79.01 D22.1 48.79,79.01 Q7.3
  Bottom Layer w1.5: v1(28.87,87.53) 25.99,87.53
  Bottom Layer w2: C19.2 23.42,90.1 P24.1
  vias: v1(27.62,88.58) v1(27.78,86.85) v1(28,87.82) v1(28.75,86.75) v1(28.87,88.31)
SGND: length 78.6
  Top Layer w0.3: U14.31 41.13,48 v1(40.4,48.72) ; v1(47.18,41.18) 47.84,41.18 48.83,42.16 U14.12 ; U14.47 39.9,37.16 v1(40.45,37.71) ; C4.1 51.58,49.6 v1(51.11,49.13) 50.6,48.62 48.79,48.62 47.63,47.46 U14.18 ; C6.1 48.82,31.99 47.63,33.18 U14.63
  Top Layer w0.4: 88.04,15.71 88.04,18.99 C9.2
  Top Layer w0.6: v1(33.77,51.32) 33.53,51.56 U19.4 ; C5.1 33.17,47.81 v1(31.47,47.81)
  Top Layer w1.2: U26.6 23.16,75.57 U26.5 ; U26.6 U26.3 ; U26.6 27.52,79.92 R65.1 ; R66.1 38,77.15 R57.2 38.44,76.58 Q4.3 ; 10.82,64.64 8.67,62.49 U25.1
  Top Layer w1.5: R66.1 34.28,79.87 R65.1
  Top Layer w2: C30.2 8.32,90.08 P29.1
  vias: v1(3.07,29.14) v1(3.07,20.06) v1(3.17,10.37) v1(4.49,29.14) v1(4.49,20.06) v1(4.6,10.37) v1(5.92,29.14) v1(5.92,20.06) v1(6.02,10.37) v1(7.76,1.65) v1(9.19,1.65) v1(9.49,12.67) v1(10.61,1.65) v1(10.92,12.67) v1(11.43,98.7) v1(11.43,97.43) v1(11.53,96.1) v1(11.79,61.63) v1(12.35,12.67) v1(12.86,98.7) v1(12.86,97.43) v1(12.96,96.1) v1(13.22,61.63) v1(14.29,98.7) v1(14.29,97.43) v1(14.39,96.1) v1(14.64,61.63) v1(15.66,61.78) v1(15.63,60.84) v1(16.38,47.19) v1(17.09,61.78) v1(17.06,60.84) v1(17.04,37.76) v1(17.4,22.46) v1(17.5,30.47) v1(17.81,47.19) v1(18.49,60.84) v1(18.47,37.76) v1(18.52,61.78) v1(18.88,53.52) v1(18.83,22.46) v1(18.93,30.47) v1(19.23,47.19) v1(19.44,42.86) v1(19.74,41.28) v1(19.74,39.19) v1(19.9,37.76) v1(20.25,22.46) v1(20.3,61.52) v1(20.3,60.1) v1(20.3,58.67) v1(20.3,53.52) v1(20.36,30.47) v1(20.56,2.11) v1(20.87,42.86) v1(20.97,9.15) v1(21.17,41.28) v1(21.17,39.19) v1(21.73,53.52) v1(21.99,2.11) v1(22.29,42.86) v1(22.4,9.15) v1(22.6,41.28) v1(22.6,39.19) v1(23.42,2.11) v1(23.72,53.62) v1(23.82,9.15) v1(25.15,53.62) v1(25.3,72.9) v1(26.07,43.42) v1(26.12,41.48) v1(26.17,38.73) v1(26.27,74.48) v1(26.37,77.18) v1(26.48,75.95) v1(26.58,53.62) v1(26.73,72.9) v1(27.24,78.76) v1(27.7,74.48) v1(27.8,77.18) v1(27.9,79.99) v1(27.9,75.95) v1(28.16,72.9) v1(28.67,78.76) v1(29.13,74.48) v1(29.23,77.18) v1(29.33,79.99) v1(29.33,75.95) v1(29.38,24.86) v1(29.59,30.06) v1(30.1,78.76) v1(30.2,74.53) v1(30.25,76.67) v1(30.3,77.95) v1(30.35,75.6) v1(30.3,17.26) v1(30.76,79.99) v1(31.22,9.05) v1(31.42,2.11) v1(31.68,76.67) v1(31.63,74.53) v1(31.73,77.95) v1(31.78,75.6) v1(31.73,17.26) v1(31.88,44.95) v1(32.39,44.44) v1(32.65,9.05) v1(32.85,2.11) v1(33.06,74.53) v1(33.11,76.67) v1(33.16,17.26) v1(33.21,75.6) v1(34.07,9.05) v1(34.13,39.44) v1(34.23,76.83) v1(34.28,2.11) v1(34.38,36.02) v1(38.27,31.04) v1(38.44,35.51) v1(38.41,33.73) v1(40.04,18.28) v1(41.11,42.81) v1(41.42,38.78) v1(41.47,18.28) v1(41.83,39.54) v1(42.18,2.16) v1(42.33,54.47) v1(42.34,42.76) v1(42.48,37.03) v1(42.9,18.28) v1(43.2,37.45) v1(43.57,98.65) v1(43.61,41.91) v1(43.61,2.16) v1(44.02,42.86) v1(44.17,96.26) v1(44.17,94.83) v1(44.17,93.4) v1(44.22,92.02) v1(44.22,90.59) v1(44.22,89.17) v1(45,98.65) v1(45.04,2.16) v1(45.19,9.1) v1(45.75,52.6) v1(46.11,39.65) v1(46.43,98.65) v1(46.62,9.1) v1(48.05,9.1) v1(48.56,98.7) v1(49.12,75.3) v1(49.99,98.7) v1(50.04,27.2) v1(50.34,48.47) v1(50.45,23.02) v1(50.55,75.3) v1(50.91,26.49) v1(51.41,98.7) v1(51.87,23.02) v1(51.98,75.3) v1(52.23,18.84) v1(53,2.21) v1(53.3,98.91) v1(53.3,23.02) v1(53.4,8.94) v1(53.66,18.84) v1(53.71,31.13) v1(54.42,2.21) v1(54.58,51.38) v1(54.58,30.36) v1(54.73,98.91) v1(54.83,8.94) v1(55.09,18.84) v1(55.85,31.23) v1(55.85,2.21) v1(55.95,35.57) v1(56.16,98.91) v1(56.26,8.94) v1(56.36,28.99) v1(57.08,34.55) v1(57.43,71.52) v1(57.64,73.31) v1(58.86,71.52) v1(58.91,36.23) v1(58.91,33.88) v1(59.06,73.31) v1(59.57,35.72) v1(59.57,29.6) v1(59.57,28.17) v1(59.57,26.74) v1(60.29,71.52) v1(60.24,56.27) v1(60.49,73.31) v1(61.2,57.13) v1(62.14,58.07) v1(62.43,11.09) v1(62.63,90.59) v1(62.99,31.48) v1(63.35,29.04) v1(63.35,27.61) v1(63.35,26.18) v1(63.5,24.19) v1(63.5,22.76) v1(63.5,21.34) v1(63.86,11.09) v1(63.96,2.11) v1(64.6,58.29) v1(65.29,11.09) v1(65.39,2.11) v1(65.41,59.09) v1(66.41,60.1) v1(66.82,2.11) v1(67.38,46.53) v1(68.81,46.53) v1(69.78,19.25) v1(69.88,59.84) v1(70.23,46.53) v1(70.44,18.12) v1(70.85,59.79) v1(71.87,18.12) v1(72.63,79.32) v1(73.29,18.12) v1(74.06,79.32) v1(74.11,87.84) v1(74.47,83.97) v1(74.42,81.26) v1(74.98,46.02) v1(75.33,86.21) v1(75.49,79.32) v1(75.9,83.97) v1(75.84,81.26) v1(76.15,57.55) v1(76.25,59.18) v1(76.41,46.02) v1(76.51,51.48) v1(76.51,50.05) v1(76.51,48.62) v1(76.76,86.21) v1(77.27,81.26) v1(77.32,83.97) v1(77.37,59.33) v1(77.43,88.15) v1(77.58,57.55) v1(77.83,46.02) v1(78.19,86.21) v1(78.14,77.49) v1(78.34,1.34) v1(78.85,88.15) v1(79.01,57.55) v1(79.57,77.49) v1(79.77,1.34) v1(80.08,82.59) v1(80.28,88.15) v1(80.21,6.87) v1(80.49,79.63) v1(81,77.49) v1(81.2,1.34) v1(81.51,82.59) v1(81.64,6.87) v1(81.91,79.63) v1(82.93,82.59) v1(83.07,6.87) v1(83.34,79.63) v1(84.57,33.17) v1(84.57,31.74) v1(84.57,30.31) v1(86.27,33.49) v1(86.27,32.06) v1(86.27,30.64) v1(87.83,44.69) v1(88.24,48.47) v1(88.49,46.38) v1(89.26,44.69) v1(89.67,48.47) v1(89.92,46.38) v1(90.69,44.69) v1(91.09,48.47) v1(91.35,46.38) v1(91.76,58.31) v1(92.37,61.52) v1(92.67,59.94) v1(92.98,74.38) v1(93.18,58.31) v1(93.8,61.52) v1(94.1,59.94) v1(94.41,74.38) v1(94.61,58.31) v1(95.22,61.52) v1(95.53,59.94) v1(95.84,74.38)
ADC: length 32.1
  Top Layer w0.3: U14.27 43.13,44.87 v1(43.51,44.49)
  Bottom Layer w0.5: v1(43.51,44.49) 51.87,52.85 P17.2
BEEP: length 14.9
  Top Layer w0.3: H#5.1 59.52,48.83 52.36,41.66 U14.11
BOOT0: length 7.4
  Top Layer w0.3: v1(46.77,32.81) 46.13,33.46 U14.60 ; R32.2 46.74,29.97 v1(46.77,30.01)
  Bottom Layer w0.3: v1(46.77,32.81) v1(46.77,30.01)
BOOT1: length 6.2
  Top Layer w0.3: R40.1 42.13,51.36 42.63,50.86 U14.28
D+: length 41.3
  Top Layer w0.3: USB_MCU.3 10.65,49.91 R17.2 v1(14.13,44.54) ; v1(31.78,40.16) 31.78,39.44 33.06,38.16 38.58,38.16
  Bottom Layer w0.3: v1(31.78,40.16) 31.78,42.91 30.05,44.64 14.24,44.64 v1(14.13,44.54)
D-: length 34
  Top Layer w0.3: U14.44 33.43,38.66 v1(32.49,39.59)
  Bottom Layer w0.3: v1(32.49,39.59) 32.49,43.11 30.45,45.15 12.84,45.15 USB_MCU.2
EXIO: length 31.5
  Top Layer w0.3: R47.1 21.49,13.87 v1(21.53,13.84) ; U14.51 41.63,32.76 v1(30.76,21.9)
  Bottom Layer w0.3: v1(21.53,13.84) 22.7,13.84 v1(30.76,21.9)
HOLD: length 26.7
  Top Layer w0.3: U14.52 42.13,31.38 v1(32.29,21.54) ; v1(27.95,15.73) 27.8,15.57 R30.1
  Bottom Layer w0.3: v1(27.95,15.73) 27.95,17.21 v1(32.29,21.54)
LASER_CTRL: length 17.5
  Top Layer w0.3: U14.26 43.63,50.39 v1(43.41,50.61)
  Bottom Layer w0.3: P.1 43.25,55.8 43.25,50.76 v1(43.41,50.61)
LED_SYS: length 15
  Top Layer w0.3: v1(40.45,40.56) 40.35,40.66 U14.40 ; v1(34.84,33.98) 34.84,33.92 D15.2
  Bottom Layer w0.3: v1(34.84,33.98) 34.99,34.14 34.99,39.19 36.37,40.56 v1(40.45,40.56)
M_EN_OUT: length 76.2
  Top Layer w0.5: P21.1 95.55,79.83 81.3,65.58 U16.13
  Bottom Layer w0.5: 95.32,95.55 95.32,91.87 93.59,90.14 93.59,81.8 95.55,79.83 P21.1 ; 95.32,95.55 92.21,92.43 84.51,92.43 81.4,95.55 ; 95.32,95.55 P20.1 ; P18.1 69.67,95.8 73.65,91.82 77.67,91.82 81.4,95.55 ; P19.1 81.4,95.55
MA_DIR: length 35.8
  Top Layer w0.3: U14.15 52.06,43.66 55.34,46.94 55.34,54.03 69.43,68.12 U16.2
MA_DIR_OUT: length 25.7
  Top Layer w0.5: P21.3 94.85,84.91 78.05,68.12 U16.15
MA_ST_OUT: length 25.1
  Top Layer w0.5: U16.14 80.03,66.85 95.55,82.37 P21.2
MA_STEP: length 35.2
  Top Layer w0.3: U14.14 52.58,43.16 56.11,46.68 56.11,53.31 69.64,66.85 U16.3
MOTOR_EN: length 42.1
  Top Layer w0.3: v1(69.37,65.4) 69.54,65.58 U16.4 ; v1(47.79,54.69) 46.69,53.58 44.58,53.58 44.63,53.54 U14.24
  Bottom Layer w0.3: v1(69.37,65.4) 69.37,60.86 63.2,54.69 v1(47.79,54.69)
MX_DIR: length 43.8
  Top Layer w0.3: U14.23 45.13,50.14 63.96,68.97 U15.2
MX_DIR_OUT: length 8.8
  Top Layer w0.5: U15.15 63.96,93.98 62.39,95.55 P18.3
MX_ST_OUT: length 8.3
  Top Layer w0.5: U15.14 65.23,94 64.93,94.3 P18.2
MX_STEP: length 44.1
  Top Layer w0.3: U15.3 65.23,69.22 45.63,49.62 U14.22
MY_DIR: length 44.5
  Top Layer w0.3: U15.4 66.5,69.62 46.13,49.25 U14.21
MY_DIR_OUT: length 16.4
  Top Layer w0.5: P19.3 76.35,95.76 76.35,93.35 75.64,92.64 68.5,92.64 66.51,90.65 66.51,87.67 U15.13
MY_ST_OUT: length 17.2
  Top Layer w0.5: P19.2 78.86,93.97 76.62,91.73 69.02,91.73 67.77,90.48 U15.12
MY_STEP: length 44.8
  Top Layer w0.3: U15.5 67.77,70.18 46.63,49.04 U14.20
MZ_DIR: length 45.7
  Top Layer w0.3: U14.17 49.87,46.16 53,49.28 53,54.54 69.04,70.58 U15.6
MZ_DIR_OUT: length 26.2
  Top Layer w0.5: P20.3 90.24,95.55 85.6,90.9 69.78,90.9 69.04,90.17 U15.11
MZ_ST_OUT: length 27
  Top Layer w0.5: U15.10 70.31,89.45 70.85,89.98 87.22,89.98 92.78,95.55 P20.2
MZ_STEP: length 47.3
  Top Layer w0.3: U14.16 51.7,44.16 53.81,46.28 53.81,53.87 70.31,70.37 U15.7
NRST: length 9.8
  Top Layer w0.3: 58.76,42.44 58.68,42.36 56.57,42.36 53.86,39.66 U14.7
PA9: length 14
  Top Layer w0.3: U14.42 36.84,39.66 v1(36.57,39.39)
  Bottom Layer w0.3: v1(36.57,39.39) 36.57,33.57 H#2.1
PA10: length 17.2
  Top Layer w0.3: U14.43 40.07,39.16 v1(40.19,39.03)
  Bottom Layer w0.3: v1(40.19,39.03) 37.34,36.18 37.34,31.8 H#2.2
PB3: length 11.3
  Top Layer w0.3: U14.55 43.63,23.55 P13#2.2
PB4: length 12
  Top Layer w0.3: U14.56 44.13,25.29 P13#2.3
PD2: length 12.2
  Top Layer w0.3: P13#2.1 43.13,25.59 U14.54
PROBE: length 32.4
  Top Layer w0.3: v1(53.05,40.87) 52.76,41.16 U14.10 ; 64.68,16.47 64.49,16.47 v1(63.25,17.72)
  Bottom Layer w0.3: v1(63.25,17.72) 61.1,19.86 61.1,32.81 v1(53.05,40.87)
PUMP_CTRL: length 18.2
  Top Layer w0.3: U14.25 44.13,51.27 v1(44.02,51.38)
  Bottom Layer w0.3: P.2 51.21,61.27 44.02,54.08 v1(44.02,51.38)
PWM_COOL: length 28.2
  Top Layer w0.3: v1(33.62,49.64) 32.26,51 U19.3 ; v1(46.31,36.84) 46.63,36.53 U14.61
  Bottom Layer w0.3: v1(33.62,49.64) 33.72,49.54 33.72,42.65 35.04,41.33 41.83,41.33 v1(46.31,36.84)
PWM_OUT: length 24.5
  Top Layer w0.4: P31#2.2 51.22,69.12 47.85,65.76 38,65.76 32.26,60.02 U19.6
RGB_DATA1: length 41.3
  Top Layer w0.3: v1(57.08,49.59) 69.25,61.77 U16.7 ; U14.57 44.63,39.89 v1(48.41,43.67)
  Bottom Layer w0.3: v1(48.41,43.67) 49.88,43.67 55.8,49.59 v1(57.08,49.59)
RGB_DATA2: length 44.3
  Top Layer w0.3: v1(50.7,45.41) 49.22,45.41 41.13,37.31 U14.50 ; U16.5 69.6,64.31 v1(57.28,51.99)
  Bottom Layer w0.3: v1(50.7,45.41) v1(57.28,51.99)
RGB_OUT1: length 23.4
  Top Layer w0.5: 96.42,51.91 93.26,51.91 87.17,58.01 82.78,58.01 79.02,61.77 U16.10
RGB_OUT2: length 20.2
  Top Layer w0.5: U16.12 82.04,64.31 85.43,67.7 P33.2
RGB_P1: length 15.7
  Top Layer w0.3: U14.35 36.48,43.16 35.3,44.34 v1(35.3,45.46)
  Bottom Layer w0.3: v1(35.3,45.46) 35.3,53.73 P23#2.3
RGB_P2: length 19.6
  Top Layer w0.3: U14.36 35.7,42.66 v1(35.45,42.91)
  Bottom Layer w0.3: P23#2.4 34.74,55.71 34.74,43.62 v1(35.45,42.91)
RGB_PO2: length 59.3
  Top Layer w0.5: v1(55.09,83.56) 50.75,87.89 P26.2 ; U16.11 82.29,63.04 82.44,62.89 R78.2
  Bottom Layer w0.5: v1(55.09,83.56) 60.95,77.69 75.59,77.69 79.98,73.31 v1(79.98,63.05)
RST: length 89.4
  Top Layer w0.3: v1(86.81,8.18) 86.81,6.92 86.59,6.7 ; v1(48.56,40) 48.72,40.16 U14.8 ; v1(56.41,15.52) 54.12,17.82 R14.1 48.54,19.28 v1(48.56,19.3) ; P16.5 98.08,17.25 98.08,10.37 94.46,6.75 C11.2
  Bottom Layer w0.3: v1(56.41,15.52) 63.76,8.18 v1(86.81,8.18) ; v1(48.56,40) v1(48.56,19.3)
RUN: length 24
  Top Layer w0.3: v1(35.35,21.9) 42.63,29.17 U14.53 ; R24.1 35.27,15.55 v1(35.25,15.57)
  Bottom Layer w0.3: v1(35.25,15.57) 35.26,15.59 35.26,21.81 v1(35.35,21.9)
RXD: length 40.7
  Top Layer w0.3: R38.1 74.78,14.05 R27.2 72.81,14.07 67.53,19.35 62.18,19.35 50.39,31.13 47.39,31.13 45.63,32.89 U14.59
RXD3: length 19.9
  Top Layer w0.3: v1(40.6,54.13) 40.6,50.66 41.63,49.64 U14.30
  Top Layer w0.4: R36.1 41.28,60.06 P14.2
  Bottom Layer w0.3: P14.2 40.6,59.38 v1(40.6,54.13)
SPINDLE_EN0: length 7.7
  Top Layer w0.3: U14.33 37.36,44.16 v1(36.98,44.54)
  Bottom Layer w0.3: P23#2.1 36.98,50.34 v1(36.98,44.54)
SPINDLE_EN1: length 11.8
  Top Layer w0.3: U14.34 36.84,43.66 36.01,44.49 v1(36.01,45.1)
  Bottom Layer w0.3: P23#2.2 36.01,51.91 v1(36.01,45.1)
SPINDLE_OUT: length 15.2
  Top Layer w0.4: U19.7 30.99,60.78 30.71,61.07 30.71,62.17 R48.1 30.72,64.75 U20.2
  Top Layer w0.5: R48.1 28.26,62.19 25.66,59.59 P31.2
SPINDLE_PWM: length 19.1
  Top Layer w0.3: U19.2 30.99,50.68 v1(31.01,50.66) ; U14.41 v1(33.16,40.16)
  Bottom Layer w0.3: v1(33.16,40.16) 33.16,48.52 v1(31.01,50.66)
SPN+: length 50.4
  Top Layer w0.5: 29.93,95.19 33.05,95.19
  Top Layer w2: P24.2 23.92,91.72 32.65,91.72 ; 33.39,88.66 33.39,95.53 P28.2
  Bottom Layer w2: P24.2 16.88,95.69 C19.1 ; P28.2 32.69,94.82 C21#2.1
SPN_PWM: length 25.2
  Top Layer w0.4: R63.1 41.79,70.91 41.82,70.87 R54.1 ; DZ1.2 36.04,71.2 Q4.2 36.34,74.27 R57.1
  Top Layer w0.5: R54.1 41.82,68.76 40.6,67.54 35.66,67.54 34.73,68.47 DZ1.2
SPN_PWM_OUT: length 18.8
  Top Layer w0.5: Q7.1 50.44,85.33 53.3,82.47 53.3,79.12 50.91,76.72 R63.2
SWCLK: length 14.5
  Top Layer w0.3: P23.3 30.79,37.66 v1(31.83,37.66) ; U14.49 40.61,34.65 v1(34.07,34.65)
  Bottom Layer w0.3: v1(31.83,37.66) 31.83,37.61 34.07,35.36 v1(34.07,34.65)
SWDIO: length 12.2
  Top Layer w0.3: P23.4 28.67,41.84 32.85,37.66 U14.46
TIM4_CH4: length 44.5
  Top Layer w0.3: v1(47.13,38.06) 47.13,38.06 U14.62 ; U16.6 73.01,63.04 73.5,62.54 73.5,60.25 72.07,58.82 68.09,58.82 v1(57.33,48.06)
  Bottom Layer w0.3: v1(47.13,38.06) 47.13,40 55.19,48.06 v1(57.33,48.06)
TXD: length 46.4
  Top Layer w0.3: R37.1 73.12,10.09 71.97,11.24 71.97,13.99 67.23,18.74 61.77,18.74 49.88,30.62 47.18,30.62 45.13,32.67 U14.58 ; R28.2 73.98,16.1 v1(73.14,15.27)
  Bottom Layer w0.3: v1(73.14,15.27) 71.92,14.04 v1(71.92,13.94)
TXD3: length 16.8
  Top Layer w0.3: v1(41.42,50.81) 42.13,50.11 U14.29
  Bottom Layer w0.3: v1(41.42,50.81) 41.42,57.6 44.98,61.16 P14.3
USB_CHK: length 33.2
  Top Layer w0.3: U14.2 53.19,37.16 57.89,32.45 66.41,32.45 68.04,34.09 68.04,41.12 68.98,42.07 R9.1
  Top Layer w0.6: R9.1 71.23,42.55 R10.2
USB_DM: length 21.4
  Top Layer w0.4: 81.69,15.71 81.69,17.95 84.67,20.93 84.67,23.17 88.38,26.89 USB_TTL.2
USB_DP: length 21.7
  Top Layer w0.4: USB_TTL.3 90.38,27.66 85.38,22.66 85.38,20.37 82.96,17.95 82.96,15.71
VCH340: length 47.9
  Top Layer w0.5: U13.16 v1(88.09,11.9) ; C48#2.2 81.49,30.65 H#4.1
  Top Layer w0.6: H#3.1 67.82,26.04 Q2.3
  Bottom Layer w0.5: H#4.1 88.09,24.09 v1(88.09,11.9)
  Bottom Layer w0.6: H#4.1 68.72,30.67 H#3.1
VUSB: length 19.6
  Top Layer w0.6: 81.54,36.79 81.62,36.87 USB_TTL.1 85.2,40.04 D7.1 ; 81.54,36.79 D5.1 ; 81.54,36.79 H.2 81.51,36.69 H#4.2
X_LIMT: length 26.5
  Top Layer w0.3: U1.4 23.16,35 v1(23.52,35.36) 23.79,35.63 R5.2 ; U14.37 31.92,42.16 30.15,43.93 v1(27.09,43.93)
  Bottom Layer w0.3: v1(23.52,35.36) 25.3,35.36 27.09,37.15 v1(27.09,43.93)
X_LO: length 11.3
  Top Layer w0.6: U1.2 14.25,32.46 14.24,32.45 P2.2
XTAL1: length 18.7
  Top Layer w0.3: C3.1 66.57,34.76 Y1.1 62.83,35.51 59.9,38.43 56.76,38.43 56.53,38.66 U14.5
XTAL2: length 19.4
  Top Layer w0.3: C2.1 66.72,44.76 Y1.2 62.83,44.01 58.76,39.94 R26.2 57.42,39.94 56.64,39.16 U14.6
Y_LIMT: length 28.8
  Top Layer w0.3: U14.38 30.63,41.66 v1(30.61,41.69) ; U2.4 24.32,26.94 R6.2 24.33,28.83 v1(24.38,28.88)
  Bottom Layer w0.3: v1(24.38,28.88) 26.22,28.88 30.45,33.12 30.45,41.53 v1(30.61,41.69)
Y_LO: length 11.6
  Top Layer w0.6: U2.2 12.91,24.4 11.85,23.34 4.48,23.34
Z_LIMT: length 33.1
  Top Layer w0.3: v1(31.12,40.72) 31.56,41.16 U14.39 ; R7.2 24.03,21.9 v1(24.08,21.95)
  Top Layer w0.4: U3.4 24.02,20.3 R7.2
  Bottom Layer w0.3: v1(31.12,40.72) 31.12,28.99 v1(24.08,21.95)
Z_LO: length 12.8
  Top Layer w0.6: P4.2 10.67,14.23 14.2,17.76 U3.2
ZERO: length 28.8
  Top Layer w0.3: v1(52.18,40.41) 51.93,40.66 U14.9 ; v1(58.04,18.07) R36#2.1
  Bottom Layer w0.3: v1(52.18,40.41) 58.04,34.55 v1(58.04,18.07)
$1N23: length 10.7
  Top Layer w0.5: R24.2 R23.1 37.17,9.99 C14.2 39.41,7.7 P12.2
$1N24: length 10.5
  Top Layer w0.5: R29.1 27.59,12.51 R30.2 27.81,12.29 C18.2 27.81,9.22 28.56,8.47 P15#2.2
$1N115: length 12.5
  Top Layer w0.5: C21.2 17.89,11.49 D11.2 17.89,8.96 17.71,8.78 P25.2 ; C21.2 17.59,11.93 R45.1 ; C21.2 19.48,11.86 R47.2
$1N25015: length 4.9
  Top Layer w0.4: 84.23,15.71 84.23,18.04 85.33,19.14 C9.1
$1N25025: length 3.7
  Top Layer w0.3: 84.59,6.7 84.59,7.09 84.23,7.44 84.23,10.24
$1N25043: length 10.4
  Top Layer w0.4: U13.7 80.47,20.71 81.24,21.48 Y2.2 81.92,21.57 C7.1
$1N25047: length 11
  Top Layer w0.4: C8.1 76.56,21.63 Y2.1 77.16,21.48 79.2,19.44 U13.8
$1N25180: length 2.2
  Top Layer w0.3: D15.1 31.83,32.78 R41.1
$1N25288: length 37.5
  Top Layer w0.4: v1(89.56,9.96) 90.94,11.34 90.94,15.71 P16.6 ; v1(77.83,9.96) 76.52,9.96 R37.2 76.39,9.31 80.94,4.76 84.26,4.76 85.53,3.49 P15.2
  Bottom Layer w0.4: v1(89.56,9.96) v1(77.83,9.96)
$1N25293: length 44.9
  Top Layer w0.4: P16.8 92.81,21.32 90.07,18.58 90.07,15.42 86.73,12.08 76.38,12.08
  Bottom Layer w0.4: P15.3 91.4,5.54 91.4,18.71 P16.8
$1N25300: length 2.7
  Top Layer w0.6: U1.1 15.45,35.17 R1.2
$1N25317: length 2.1
  Top Layer w0.6: R18#2.1 71.29,28.29 Q2.1
$1N25319: length 5.8
  Top Layer w0.6: R16.1 73.02,30.15 R18#2.2 72.89,30.72 71.18,32.43 Q1.2
$1N25330: length 24.7
  Top Layer w0.4: 86.77,15.71 86.77,14.21 85.64,13.07 78.5,13.07 77.5,14.07 R27.1
  Bottom Layer w0.4: v1(77.53,13.99) 77.53,15.46 P13.2
$1N25334: length 19.7
  Top Layer w0.4: 85.5,15.71 85.5,14.52 84.92,13.94 78.96,13.94 76.79,16.1 R28.1 76.38,17.39 72.69,21.07 P13.3
$1N25342: length 2.4
  Top Layer w0.6: D7.2 84.78,43.65 R18.1
$1N25345: length 6.4
  Top Layer w0.6: R11.1 73.02,38.85 R12.2 71.47,37.1 Q1.1
$1N25456: length 3.2
  Top Layer w0.6: U2.1 12.43,26.94 12.4,26.91
$1N25466: length 3.3
  Top Layer w0.6: R3.2 15.59,20.33 U3.1
$1N25569: length 5
  Top Layer w0.6: R10.1 74.64,40.52 R11.2 76.9,40.5 D5.2
$1N28653: length 29.1
  Top Layer w0.4: R14.2 46.94,10.77 46.96,10.76
  Top Layer w0.5: K1.4 K1.3 41.81,10.76 R13.1 ; K1.4 51.71,9.61 50.26,8.16 P5.2 ; K1.4 52.73,10.76 C9#2.2
$1N38223: length 13.4
  Top Layer w0.5: P19#2.2 61.11,8.77 D8.2 60.11,12.3 60.04,12.36 60.54,12.86 R35.1 R36#2.2
$1N68371: length 15.7
  Top Layer w0.5: R95.2 66.87,14.88 R96.1 66.88,13.98 67.53,13.33 68.86,13.33 69.53,12.66 C55.2 70.32,11.11 D27.2 71.96,8.32 P35.2
$6N26743: length 33.5
  Top Layer w0.5: P28.1 38.16,99.16 31.7,99.16 29.84,97.31 D23.2
  Top Layer w1.8: Q7.2 44.84,82.79 D22.2 44.43,84.49 40.26,88.66
  Top Layer w2: P28.1 40.26,97.06 40.26,88.66
$6N26746: length 2.2
  Top Layer w0.5: 28.33,95.19 28.14,95.37 D23.1
$6N26802: length 9.6
  Top Layer w0.4: R51.1 R49.2 ; Q4.1 37.6,72.13 v1(37.54,72.13) ; v1(33.41,71.62) 33.29,71.5 32.03,71.5
  Bottom Layer w0.4: v1(37.54,72.13) 33.92,72.13 v1(33.41,71.62)
$6N26803: length 2.5
  Top Layer w0.4: 32.03,69.91 31.66,69.53 U20.4
$6N26814: length 4.9
  Top Layer w0.4: R78.1 84.63,61.29 Q13.1 85.38,60.42 R80.1
$6N26816: length 2.3
  Bottom Layer w0.4: Q12.1 87.88,74.82 R81.2
$6N26817: length 17.1
  Top Layer w0.4: v1(85.23,65.5) 86.13,64.6 Q13.3 87.16,63.78 R79.1
  Bottom Layer w0.4: R81.1 84.51,74.99 83.44,73.92 83.44,67.29 v1(85.23,65.5)
$6N26825: length 3.9
  Top Layer w0.6: R76.1 81.78,47.79 Q11.1 81.61,49.42 R74.1
$6N26827: length 2.2
  Top Layer w0.4: R77.2 83.09,55.43 Q10.1
$6N26828: length 10.4
  Top Layer w0.4: 81.13,55.78 79.92,54.58 79.92,53.16 81.26,51.82 Q11.3 82.74,51.8 84.44,50.1 85.44,50.1 R75.1
$6N26878: length 13.8
  Top Layer w1.2: D27#2.2 6.28,84.23 L2.1 6.42,80.67 U26.2

## Copper pours and planes (outline as drawn; the poured copper is in the pictures)
5V_VCC on Top Layer: 2.96,66.88 4.86,66.88 4.86,61.29 2.96,61.29
5V_VCC on Top Layer: 11.18,77.39 13.55,77.39 13.55,69.69 11.18,69.69
5V_VCC on Top Layer: 2.96,70.3 16.68,70.3 16.68,66.11 2.96,66.11
5V_VCC on Top Layer: 12.6,66.78 16.28,66.78 16.28,63.62 12.6,63.62
24V on Top Layer: 14.18,86.94 18.75,86.94 18.75,81.87 14.18,81.87
24V on Top Layer: 4.14,87.64 21.85,87.64 21.85,85.9 4.14,85.9
24V on Top Layer: 1.23,98.5 4.7,98.5 4.7,86.73 1.23,86.73
48V_SPN- on Top Layer: 32.44,84.63 39.94,84.63 39.94,78.81 32.44,78.81
48V_SPN- on Top Layer: 27.14,88.96 30.56,88.96 30.56,86.31 27.14,86.31
48V_SPN- on Bottom Layer: 21.99,98.7 29.89,98.7 29.89,86.36 21.99,86.36
SGND on Top Layer: -1.37,102.27 102.01,102.27 102.01,-1.67 -1.37,-1.67
SGND on Bottom Layer: -1.83,102.48 102.47,102.48 102.47,-1.82 -1.83,-1.82
$6N26878 on Top Layer: 5.21,83.56 13.06,83.56 13.06,79.02 5.21,79.02

Small or netless copper shapes (teardrops, artwork), in the pictures only: 469 on Top Layer, 136 on Bottom Layer

## Text on the board
Top Silkscreen Layer: +  EXIO  - | +  HOLD  - | +  RUN  - | GND_X | GND_Y | GND_Z | + RESET - | +  ZERO  - | +  PROBE  - | GND | CLK | DIO | PB15 | PB12 | RX | TX | 24V_Test_GND | PB0 | PC5 | 5V_DIR_STEP_EN | VCC_CH340 | 5V | ADC | R | T | 5V_DATA_GND | 24V+ GND | 48V+ GND | PWM | 24V | SPN+ | SPN- | Test
